# EAGLE design PT2258-S_Breakout (EAGLE 9.6.2)
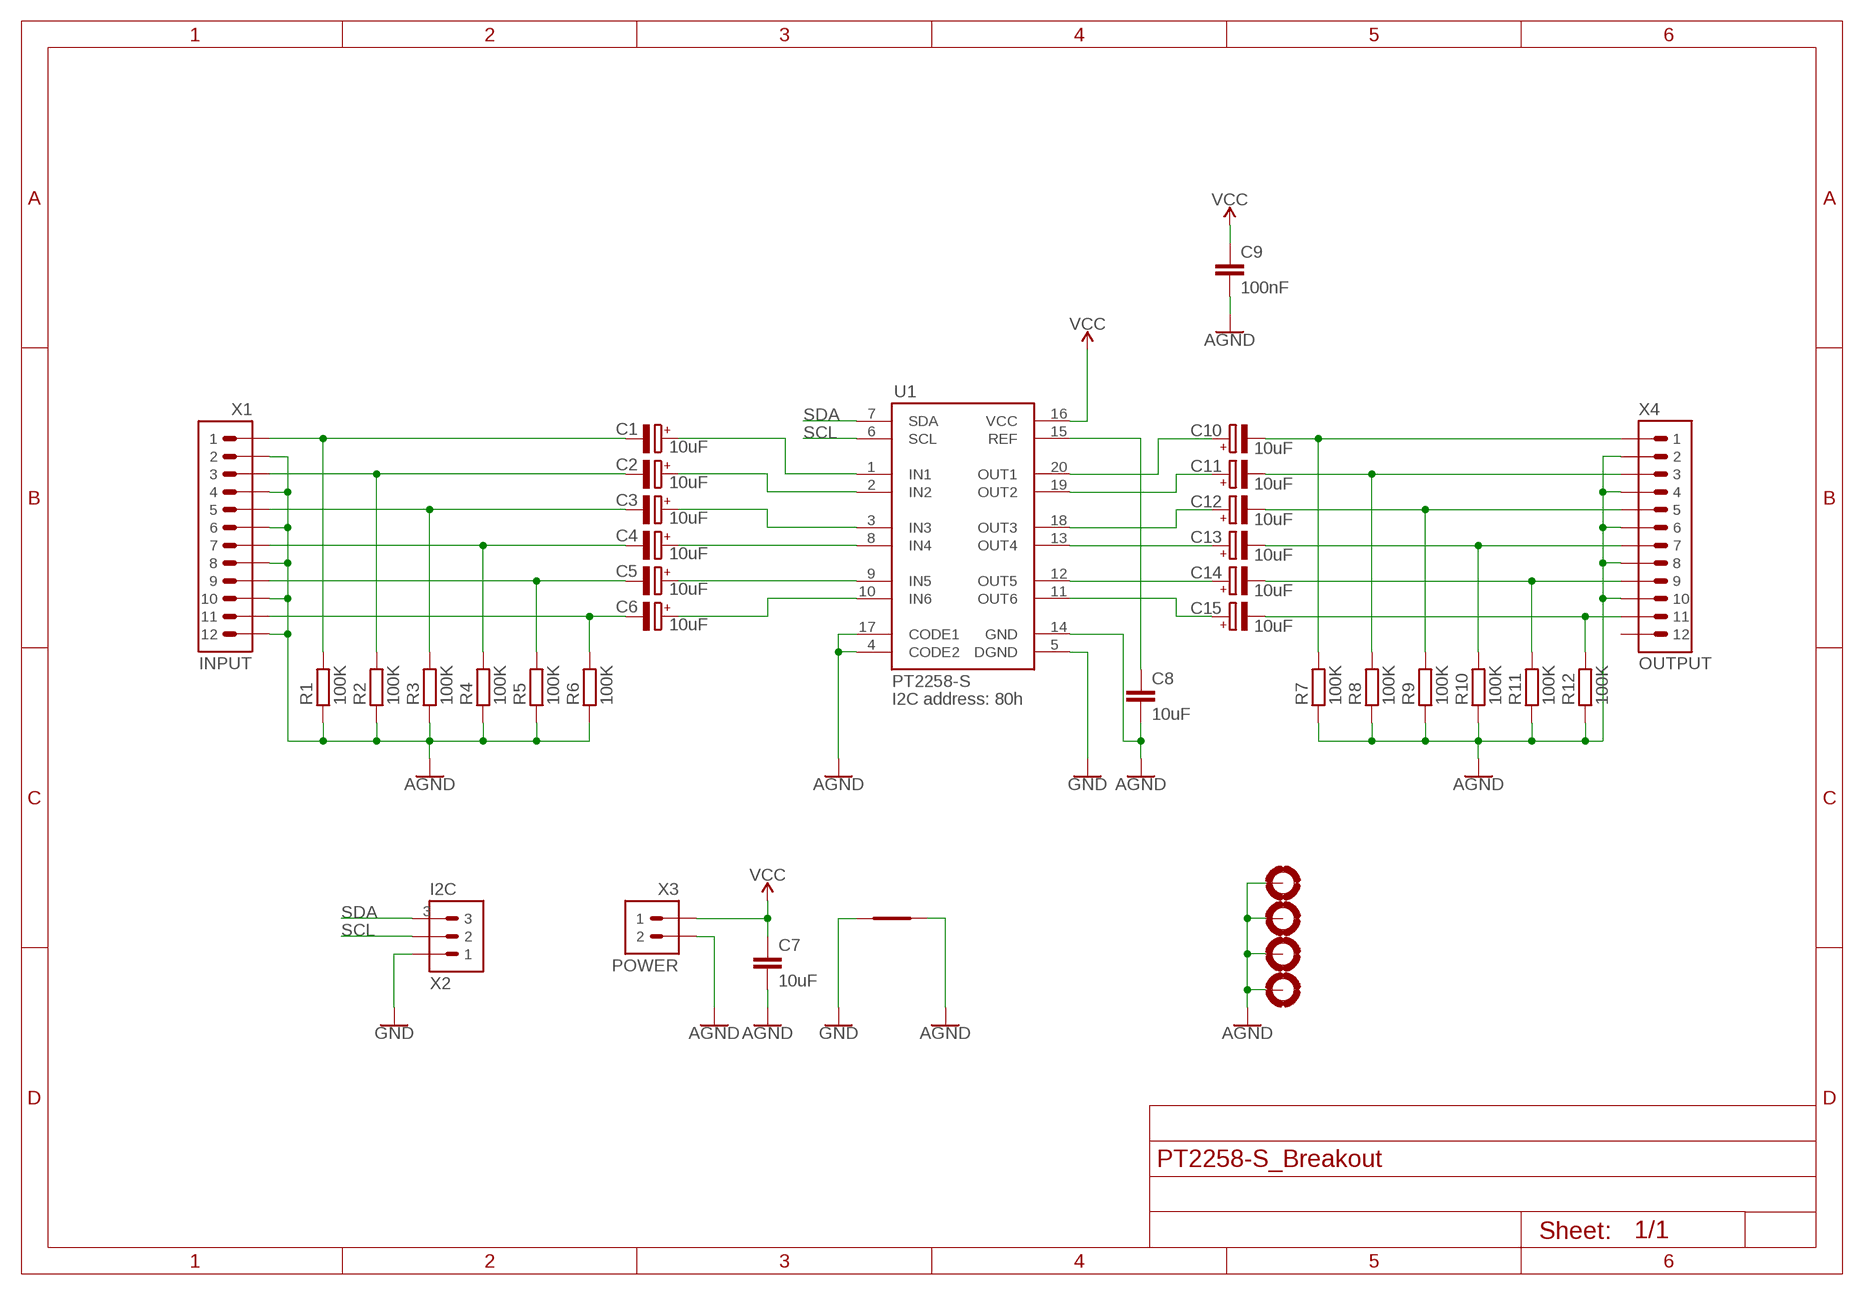
[diagram p0: schematic, sheet 1]

## Parts
C1  10uF  CAP-POL-ALUMROQANG-RVT0405  [ROQANG-RVT0405]
C2  10uF  CAP-POL-ALUMROQANG-RVT0405  [ROQANG-RVT0405]
C3  10uF  CAP-POL-ALUMROQANG-RVT0405  [ROQANG-RVT0405]
C4  10uF  CAP-POL-ALUMROQANG-RVT0405  [ROQANG-RVT0405]
C5  10uF  CAP-POL-ALUMROQANG-RVT0405  [ROQANG-RVT0405]
C6  10uF  CAP-POL-ALUMROQANG-RVT0405  [ROQANG-RVT0405]
C7  10uF  CAPC0603  [C0603]
C8  10uF  CAPC0603  [C0603]
C9  100nF  CAPC0603  [C0603]
C10  10uF  CAP-POL-ALUMROQANG-RVT0405  [ROQANG-RVT0405]
C11  10uF  CAP-POL-ALUMROQANG-RVT0405  [ROQANG-RVT0405]
C12  10uF  CAP-POL-ALUMROQANG-RVT0405  [ROQANG-RVT0405]
C13  10uF  CAP-POL-ALUMROQANG-RVT0405  [ROQANG-RVT0405]
C14  10uF  CAP-POL-ALUMROQANG-RVT0405  [ROQANG-RVT0405]
C15  10uF  CAP-POL-ALUMROQANG-RVT0405  [ROQANG-RVT0405]
H1  MOUNTHOLE-PAD3.2  [3.2-PAD]
H2  MOUNTHOLE-PAD3.2  [3.2-PAD]
H3  MOUNTHOLE-PAD3.2  [3.2-PAD]
H4  MOUNTHOLE-PAD3.2  [3.2-PAD]
R1  100K  RESISTOR0603  [R0603]
R2  100K  RESISTOR0603  [R0603]
R3  100K  RESISTOR0603  [R0603]
R4  100K  RESISTOR0603  [R0603]
R5  100K  RESISTOR0603  [R0603]
R6  100K  RESISTOR0603  [R0603]
R7  100K  RESISTOR0603  [R0603]
R8  100K  RESISTOR0603  [R0603]
R9  100K  RESISTOR0603  [R0603]
R10  100K  RESISTOR0603  [R0603]
R11  100K  RESISTOR0603  [R0603]
R12  100K  RESISTOR0603  [R0603]
SH1  SHORT-SMD-06096  [SHORT-SMD-06096]
U1  PT2258-S  [SOP-20-300]
X1  INPUT  HEADER-1X12-2.54  [1X12-2.54]
X2  I2C  HEADER-1X03-2.54P  [1X03P-2.54]
X3  POWER  HEADER-1X02-2.54POL  [1X02P-2.54]
X4  OUTPUT  HEADER-1X12-2.54  [1X12-2.54]

## Nets
AGND: C7.2 C8.2 C9.2 H1.B3,2(MOUNT) H2.B3,2(MOUNT) H3.B3,2(MOUNT) H4.B3,2(MOUNT) R1.1 R2.1 R3.1 R4.1 R5.1 R6.1 R7.1 R8.1 R9.1 R10.1 R11.1 R12.1 SH1.2 U1.4(CODE2) U1.14(GND) U1.17(CODE1) X1.2 X1.4 X1.6 X1.8 X1.10 X1.12 X3.2 X4.2 X4.4 X4.6 X4.8 X4.10
GND: SH1.1 U1.5(DGND) X2.1
N$1: C10.- R7.2 X4.1
N$2: C11.- R8.2 X4.3
N$3: C12.- R9.2 X4.5
N$4: C13.- R10.2 X4.7
N$5: C14.- R11.2 X4.9
N$6: C15.- R12.2 X4.11
N$7: C4.+ U1.8(IN4)
N$8: C1.+ U1.1(IN1)
N$9: C15.+ U1.11(OUT6)
N$10: C14.+ U1.12(OUT5)
N$11: C13.+ U1.13(OUT4)
N$12: C12.+ U1.18(OUT3)
N$13: C11.+ U1.19(OUT2)
N$14: C10.+ U1.20(OUT1)
N$15: C8.1 U1.15(REF)
N$16: C2.+ U1.2(IN2)
N$17: C3.+ U1.3(IN3)
N$18: C5.+ U1.9(IN5)
N$19: C6.+ U1.10(IN6)
N$20: C1.- R1.2 X1.1
N$21: C2.- R2.2 X1.3
N$22: C3.- R3.2 X1.5
N$23: C4.- R4.2 X1.7
N$24: C5.- R5.2 X1.9
N$25: C6.- R6.2 X1.11
SCL: U1.6(SCL) X2.2
SDA: U1.7(SDA) X2.3
VCC: C7.1 C9.1 U1.16(VCC) X3.1
Unconnected: X4.12

## Notes on the sheet
- I2C address: 80h

## Library data of the parts
C1-C6 C10-C15 = M2M-Passives:CAP-POL-ALUM
C7-C9 = M2M-Passives:CAP
H1-H4 = M2M-Holes:MOUNTHOLE-PAD
R1-R12 = M2M-Passives:RESISTOR
SH1 = M2M-Connectors:SHORT
U1 = M2M-IC:PT2258
X1 X4 = M2M-Connectors:HEADER-1X12-2.54
X2 = M2M-Connectors:HEADER-1X03-2.54
X3 = M2M-Connectors:HEADER-1X02-2.54

## Board
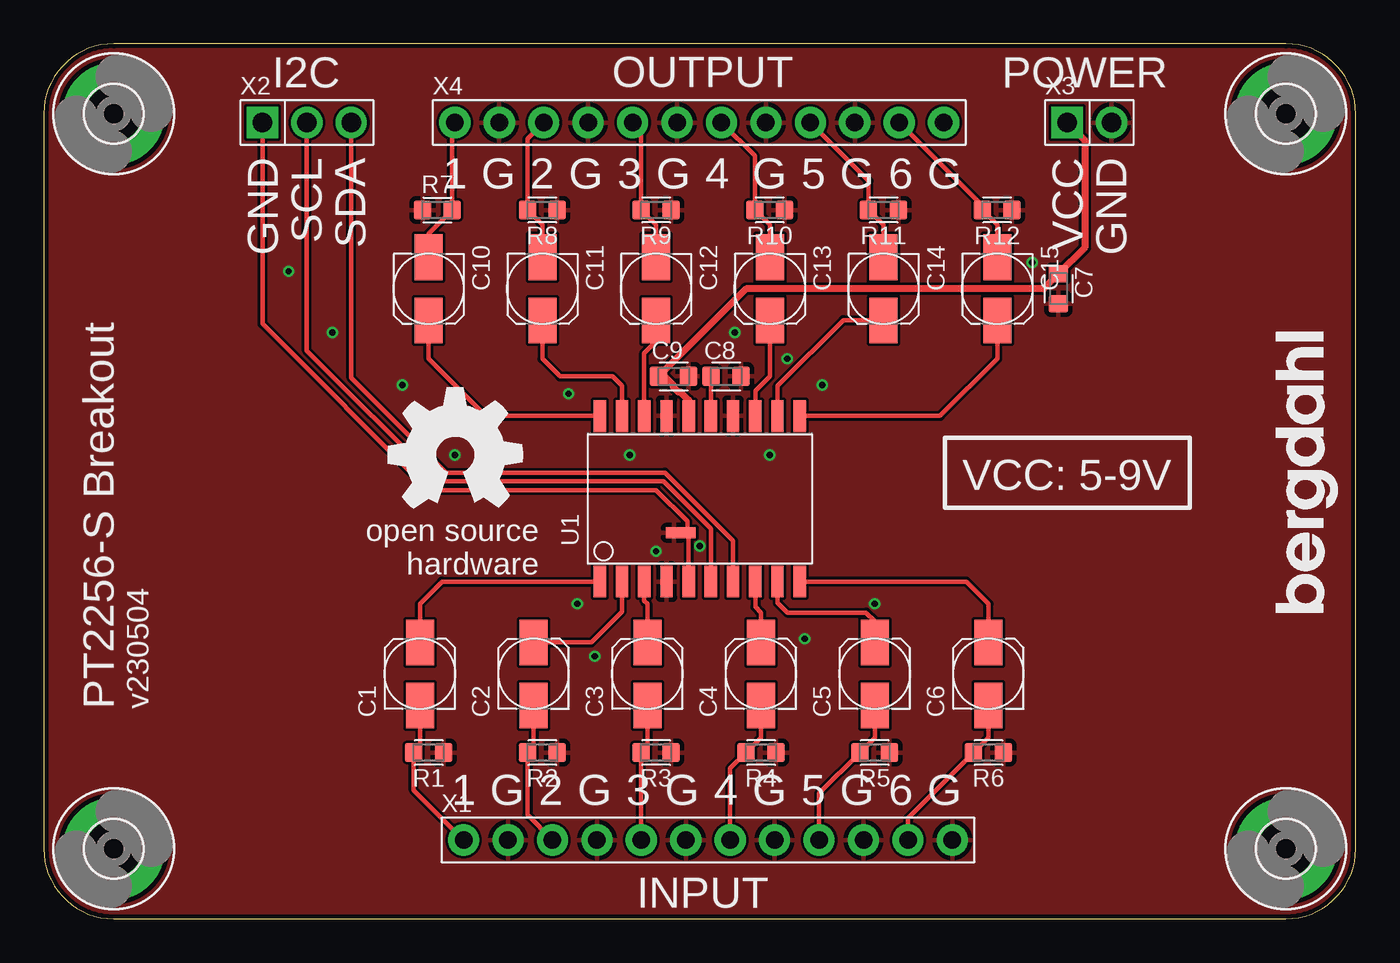
[diagram p1: board, top side]
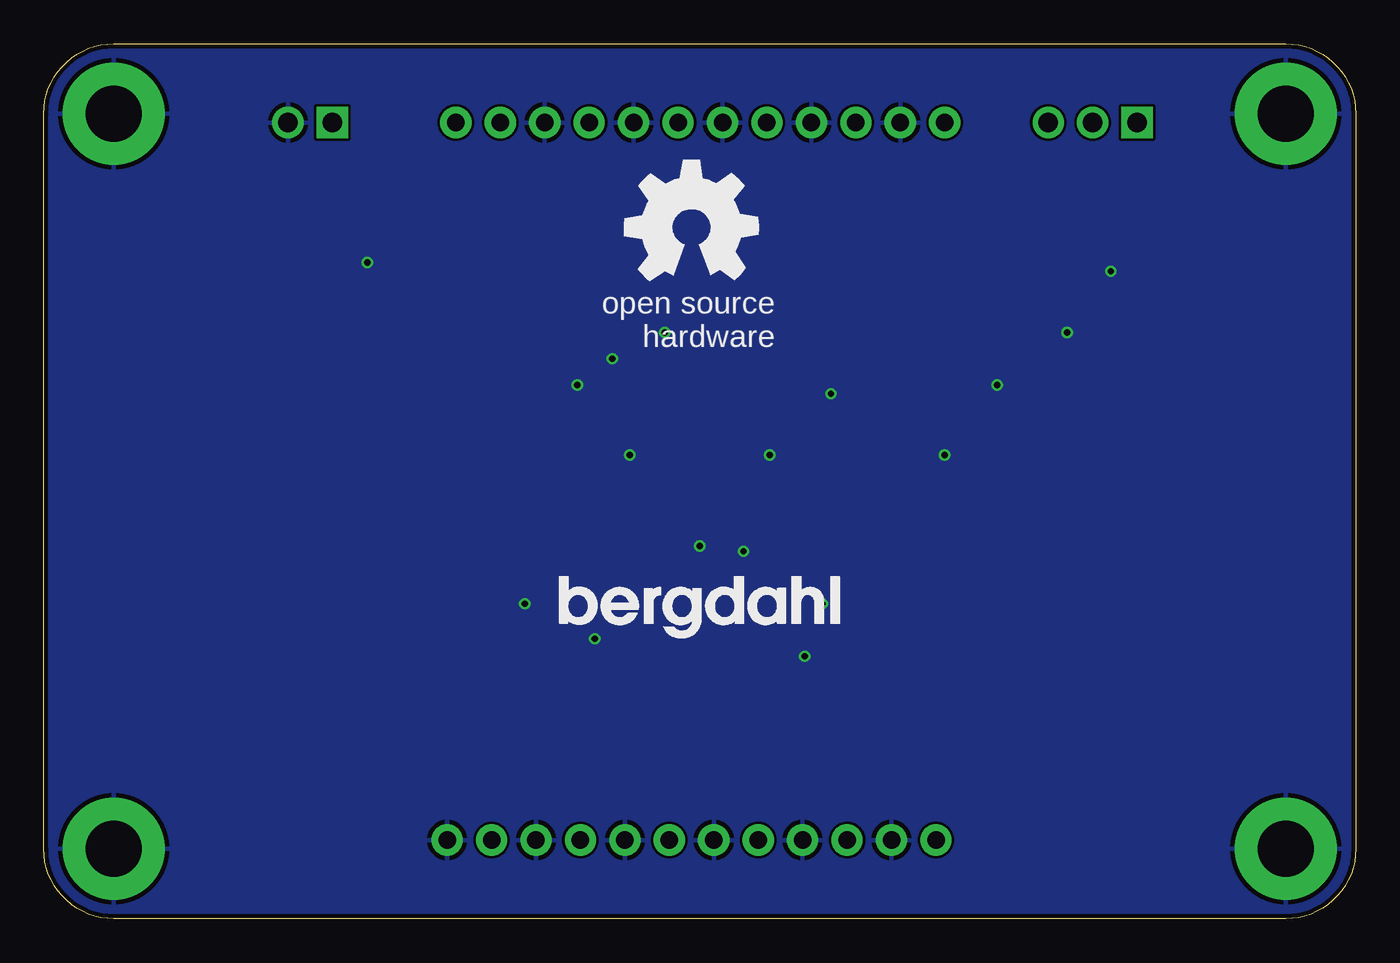
[diagram p2: board, bottom side, seen from below]

Size 75 x 50 mm. Coordinates in mm from the lower left corner, seen from the top.
Outline: 0,46 0,4 arc90 4,0 71,0 arc90 75,4 75,46 arc90 71,50 4,50 arc90 0,46
Copper layers (1*16): Top 0.035mm / dielectric 1.5mm / Bottom 0.035mm
Design rules "SeeedStudio_2layer_DRU_no_angle_20140221": minimum track width 6mil, minimum drill 0.3mm, track to track 6mil, track to pad 6mil, pad to pad 6mil, via to via 6mil, smd to smd 0mil, copper to edge 10mil, drill to drill 10mil, minimum pad ring 2mil, minimum via ring 6mil, stop-mask expansion 2mil, vias tented up to drill 1000mil, thermal gap 10mil

### Footprints (pad centres in the part's own frame; a part is rotated, then mirrored left to right if it is on the bottom)
ROQANG-RVT0405 = smd 1.6 x 2.6: + 0,1.8; - 0,-1.8
C0603 = smd 1 x 1.1: 1 -0.85,0; 2 0.85,0
3.2-PAD = drill 3.2 pad 5.842: B3,2 0,0
R0603 = smd 1 x 1.1: 1 -0.85,0; 2 0.85,0
SHORT-SMD-06096 = smd 1 x 0.61: 1 -0.381,0; 2 0.381,0
SOP-20-300 = smd 0.7 x 1.8: 1 -5.715,-4.73; 2 -4.445,-4.73; 3 -3.175,-4.73; 4 -1.905,-4.73; 5 -0.635,-4.73; 6 0.635,-4.73; 7 1.905,-4.73; 8 3.175,-4.73; 9 4.445,-4.73; 10 5.715,-4.73; 11 5.715,4.73; 12 4.445,4.73; 13 3.175,4.73; 14 1.905,4.73; 15 0.635,4.73; 16 -0.635,4.73; 17 -1.905,4.73; 18 -3.175,4.73; 19 -4.445,4.73; 20 -5.715,4.73
1X12-2.54 = drill 1 pad 1.778: 1 0,0; 2 2.54,0; 3 5.08,0; 4 7.62,0; 5 10.16,0; 6 12.7,0; 7 15.24,0; 8 17.78,0; 9 20.32,0; 10 22.86,0; 11 25.4,0; 12 27.94,0
1X03P-2.54 = drill 1.1 pad 1.778 square: 1 0,0 | drill 1.1 pad 1.778: 2 2.54,0; 3 5.08,0
1X02P-2.54 = drill 1.1 pad 1.778 square: 1 0,0 | drill 1.1 pad 1.778: 2 2.54,0

### Placement (x,y rotation side)
C1  21.5,14 0 top
C2  28,14 0 top
C3  34.5,14 0 top
C4  41,14 0 top
C5  47.5,14 0 top
C6  54,14 0 top
C7  58,36 270 top
C8  39,31 0 top
C9  36,31 0 top
C10  22,36 180 top
C11  28.5,36 180 top
C12  35,36 180 top
C13  41.5,36 180 top
C14  48,36 180 top
C15  54.5,36 180 top
H1  4,4 0 top
H2  4,46 0 top
H3  71,46 0 top
H4  71,4 0 top
R1  22,9.5 180 top
R2  28.5,9.5 180 top
R3  35,9.5 180 top
R4  41,9.5 180 top
R5  47.5,9.5 180 top
R6  54,9.5 180 top
R7  22.5,40.5 0 top
R8  28.5,40.5 180 top
R9  35,40.5 180 top
R10  41.5,40.5 180 top
R11  48,40.5 180 top
R12  54.5,40.5 180 top
SH1  36.41,22.06 180 top
U1  37.5,24 0 top
U$1  [BERGDAHL-20MM-BPLACE]  29.5,16 0 top
U$2  [OSHW-8MM-BPLACE]  38,39.5 0 top
U$3  [BERGDAHL-20MM-TPLACE]  74,17.5 90 top
U$5  [OSHW-8MM-TPLACE]  23.5,26.5 0 top
X1  24,4.5 0 top
X2  12.5,45.5 0 top
X3  58.5,45.5 0 top
X4  23.5,45.5 0 top

### Tracks (layer width: path | path; a pad name or v marks a point on that pad's centre or on a via)
AGND  (via drill 0.35)
  other vias: 14,37 16.5,33.5 20.5,30.5 30,30 33.5,26.5 39.5,33.5 41.5,26.5 42.5,32 44.5,30.5 47.5,18 43.5,16 35,21 31.5,15 30.5,18 37.5,21.3 23.5,26.5 56.5,37.5
  pour Top: 0,50 75,50 75,0 0,0
  pour Bottom: 0,50 75,50 75,0 0,0
GND
  Top 0.254: U1.5 36.87,21.99 SH1.1 36.79,22.71 35,24.5 22,24.5 12.5,34 X2.1
N$1
  Top 0.254: C10.- 22,39.15 R7.2 23.35,45.35 X4.1
N$2
  Top 0.254: C11.- 28.5,39.65 R8.2 27.65,44.57 X4.3
N$3
  Top 0.254: C12.- 35,39.65 R9.2 34.15,45.01 X4.5
N$4
  Top 0.254: C13.- 41.5,39.65 R10.2 40.65,43.59 X4.7
N$5
  Top 0.254: C14.- 48,39.65 R11.2 47.15,42.17 X4.9
N$6
  Top 0.254: C15.- 54.5,39.65 R12.2 53.65,40.75 X4.11
N$7
  Top 0.254: U1.8 40.67,17.82 41,17.5 C4.+
N$8
  Top 0.254: C1.+ 21.5,18 22.77,19.27 U1.1
N$9
  Top 0.254: U1.11 51.23,28.73 54.5,32 C15.+
N$10
  Top 0.254: U1.12 41.95,30.45 45.7,34.2 C14.+
N$11
  Top 0.254: U1.13 40.67,30.18 41.5,31 C13.+
N$12
  Top 0.254: C12.+ 35,34 35,33 34.33,32.33 U1.18
N$13
  Top 0.254: C11.+ 28.5,32 29.5,31 32.5,31 33.05,30.45 U1.19
N$14
  Top 0.254: U1.20 25.27,28.73 22,32 C10.+
N$15
  Top 0.254: U1.15 38.13,30.98 C8.1
N$16
  Top 0.254: U1.2 33.05,17.55 31.3,15.8 C2.+
N$17
  Top 0.254: U1.3 34.33,18.18 34.5,18 C3.+
N$18
  Top 0.254: U1.9 41.95,18.05 42.5,17.5 47,17.5 47.5,17 C5.+
N$19
  Top 0.254: C6.+ 54,18 52.73,19.27 U1.10
N$20
  Top 0.254: X1.1 21.15,7.35 R1.2 21.5,9.85 C1.-
N$21
  Top 0.254: C2.- 28,9.85 R2.2 27.65,5.93 X1.3
N$22
  Top 0.254: X1.5 R3.2 34.5,9.85 C3.-
N$23
  Top 0.254: C4.- 41,10.35 R4.2 39.24,8.59 X1.7
N$24
  Top 0.254: C5.- 47.5,10.35 R5.2 44.32,7.17 X1.9
N$25
  Top 0.254: C6.- 54,10.35 R6.2 49.4,5.75 X1.11
SCL
  Top 0.254: U1.6 38.13,22.29 35.42,25 22.5,25 15.04,32.46 X2.2
SDA
  Top 0.254: U1.7 39.41,21.59 35.5,25.5 23,25.5 17.58,30.92 X2.3
VCC
  Top 0.406: X3.1 59.5,44.5 59.5,38.35 C7.1 57.15,36 40.15,36 C9.1 35.49,31 35.99,30.5 35.99,30.38 36.28,30.09 36.41,30.09 36.87,29.64 U1.16

### Text on the board
tPlace: I2C | OUTPUT | POWER | GND | SCL | SDA | 1 | G | 2 | G | 3 | G | 4 | G | 5 | G | 6 | G | VCC | GND | VCC: 5-9V | PT2256-S Breakout | v230504 | 1 | G | 2 | G | 3 | G | 4 | G | 5 | G | 6 | G | INPUT